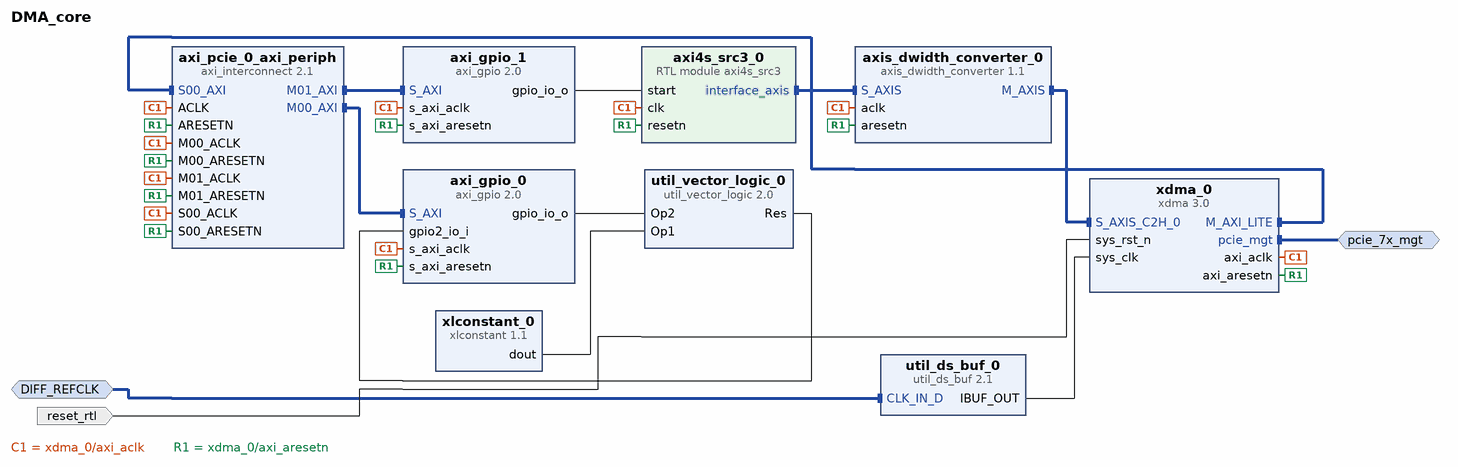
[diagram p0: block diagram of the top level]
# Vivado block design DMA_core, xc7a200tffv1156-2, Vivado 2016.4
create_bd_design DMA_core

create_bd_intf_port -mode Master -vlnv xilinx.com:interface:pcie_7x_mgt_rtl:1.0 pcie_7x_mgt
create_bd_intf_port -mode Slave -vlnv xilinx.com:interface:diff_clock_rtl:1.0 DIFF_REFCLK
set_property -dict {CONFIG.FREQ_HZ 100000000} [get_bd_intf_ports DIFF_REFCLK]
create_bd_port -dir I -type rst reset_rtl
set_property -dict {CONFIG.POLARITY ACTIVE_LOW} [get_bd_ports reset_rtl]

create_bd_cell -type ip -vlnv xilinx.com:ip:axi_gpio:2.0 axi_gpio_0
set_property -dict [list \
  CONFIG.C_IS_DUAL 1 \
  CONFIG.C_ALL_INPUTS 0 \
  CONFIG.C_ALL_INPUTS_2 1 \
  CONFIG.C_ALL_OUTPUTS 1 \
] [get_bd_cells axi_gpio_0]
create_bd_cell -type ip -vlnv xilinx.com:ip:axi_gpio:2.0 axi_gpio_1
set_property -dict {CONFIG.C_GPIO_WIDTH 1 CONFIG.C_ALL_OUTPUTS 1} [get_bd_cells axi_gpio_1]
create_bd_cell -type ip -vlnv xilinx.com:ip:axi_interconnect:2.1 axi_pcie_0_axi_periph
set_property -dict {CONFIG.NUM_SI 1 CONFIG.NUM_MI 2} [get_bd_cells axi_pcie_0_axi_periph]
create_bd_cell -type ip -vlnv xilinx.com:ip:axis_dwidth_converter:1.1 axis_dwidth_converter_0
set_property -dict [list \
  CONFIG.S_TDATA_NUM_BYTES 88 \
  CONFIG.M_TDATA_NUM_BYTES 16 \
  CONFIG.HAS_MI_TKEEP 1 \
] [get_bd_cells axis_dwidth_converter_0]
create_bd_cell -type ip -vlnv xilinx.com:ip:util_vector_logic:2.0 util_vector_logic_0
set_property -dict {CONFIG.C_SIZE 32 CONFIG.C_OPERATION xor} [get_bd_cells util_vector_logic_0]
create_bd_cell -type ip -vlnv xilinx.com:ip:xlconstant:1.1 xlconstant_0
set_property -dict {CONFIG.CONST_WIDTH 32 CONFIG.CONST_VAL 0x12345678} [get_bd_cells xlconstant_0]
create_bd_cell -type ip -vlnv xilinx.com:ip:util_ds_buf:2.1 util_ds_buf_0
set_property -dict {CONFIG.C_BUF_TYPE IBUFDSGTE} [get_bd_cells util_ds_buf_0]
create_bd_cell -type ip -vlnv xilinx.com:ip:xdma:3.0 xdma_0
set_property -dict [list \
  CONFIG.mode_selection Basic \
  CONFIG.pl_link_cap_max_link_width X4 \
  CONFIG.pl_link_cap_max_link_speed 5.0_GT/s \
  CONFIG.axi_data_width 128_bit \
  CONFIG.axisten_freq 125 \
  CONFIG.vendor_id 32ab \
  CONFIG.pf0_device_id 1333 \
  CONFIG.pf0_subsystem_vendor_id 32ab \
  CONFIG.pf0_base_class_menu Device_was_built_before_Class_Code_definitions_were_finalized \
  CONFIG.pf0_class_code_base 00 \
  CONFIG.pf0_sub_class_interface_menu All_currently_implemented_devices_except_VGA-compatible_devices \
  CONFIG.pf0_class_code_sub 00 \
  CONFIG.pf0_class_code_interface 00 \
  CONFIG.axilite_master_en true \
  CONFIG.axilite_master_size 1 \
  CONFIG.axist_bypass_en false \
  CONFIG.pciebar2axibar_axil_master 0x0000000040000000 \
  CONFIG.xdma_rnum_chnl 1 \
  CONFIG.xdma_wnum_chnl 1 \
  CONFIG.xdma_axilite_slave false \
  CONFIG.plltype QPLL1 \
  CONFIG.xdma_axi_intf_mm AXI_Stream \
  CONFIG.xdma_pcie_64bit_en true \
  CONFIG.cfg_mgmt_if false \
  CONFIG.axil_master_64bit_en true \
] [get_bd_cells xdma_0]
create_bd_cell -type module -reference axi4s_src3 axi4s_src3_0

# ---- connections ----

connect_bd_intf_net [get_bd_intf_pins axi4s_src3_0/interface_axis] [get_bd_intf_pins axis_dwidth_converter_0/S_AXIS]
connect_bd_intf_net [get_bd_intf_pins axis_dwidth_converter_0/M_AXIS] [get_bd_intf_pins xdma_0/S_AXIS_C2H_0]
connect_bd_intf_net [get_bd_intf_pins axi_pcie_0_axi_periph/S00_AXI] [get_bd_intf_pins xdma_0/M_AXI_LITE]
connect_bd_intf_net [get_bd_intf_pins axi_pcie_0_axi_periph/M00_AXI] [get_bd_intf_pins axi_gpio_0/S_AXI]
connect_bd_intf_net [get_bd_intf_pins axi_pcie_0_axi_periph/M01_AXI] [get_bd_intf_pins axi_gpio_1/S_AXI]
connect_bd_intf_net [get_bd_intf_ports pcie_7x_mgt] [get_bd_intf_pins xdma_0/pcie_mgt]
connect_bd_intf_net [get_bd_intf_ports DIFF_REFCLK] [get_bd_intf_pins util_ds_buf_0/CLK_IN_D]
connect_bd_net -net axi_pcie_0_axi_aclk_out [get_bd_pins xdma_0/axi_aclk] \
  [get_bd_pins axi_gpio_0/s_axi_aclk] [get_bd_pins axi_gpio_1/s_axi_aclk] [get_bd_pins axis_dwidth_converter_0/aclk] \
  [get_bd_pins axi4s_src3_0/clk] [get_bd_pins axi_pcie_0_axi_periph/ACLK] [get_bd_pins axi_pcie_0_axi_periph/S00_ACLK] \
  [get_bd_pins axi_pcie_0_axi_periph/M00_ACLK] [get_bd_pins axi_pcie_0_axi_periph/M01_ACLK]
connect_bd_net [get_bd_ports reset_rtl] [get_bd_pins xdma_0/sys_rst_n]
connect_bd_net [get_bd_pins xlconstant_0/dout] [get_bd_pins util_vector_logic_0/Op1]
connect_bd_net [get_bd_pins axi_gpio_0/gpio_io_o] [get_bd_pins util_vector_logic_0/Op2]
connect_bd_net [get_bd_pins util_vector_logic_0/Res] [get_bd_pins axi_gpio_0/gpio2_io_i]
connect_bd_net [get_bd_pins axi_gpio_1/gpio_io_o] [get_bd_pins axi4s_src3_0/start]
connect_bd_net [get_bd_pins util_ds_buf_0/IBUF_OUT] [get_bd_pins xdma_0/sys_clk]
connect_bd_net [get_bd_pins xdma_0/axi_aresetn] \
  [get_bd_pins axi_gpio_0/s_axi_aresetn] [get_bd_pins axi_gpio_1/s_axi_aresetn] [get_bd_pins axis_dwidth_converter_0/aresetn] \
  [get_bd_pins axi4s_src3_0/resetn] [get_bd_pins axi_pcie_0_axi_periph/S00_ARESETN] \
  [get_bd_pins axi_pcie_0_axi_periph/M00_ARESETN] [get_bd_pins axi_pcie_0_axi_periph/M01_ARESETN] \
  [get_bd_pins axi_pcie_0_axi_periph/ARESETN]

# ---- address map ----
assign_bd_address -offset 0x40000000 -range 64K -target_address_space [get_bd_addr_spaces xdma_0/M_AXI_LITE] [get_bd_addr_segs axi_gpio_0/S_AXI/Reg]
assign_bd_address -offset 0x40010000 -range 64K -target_address_space [get_bd_addr_spaces xdma_0/M_AXI_LITE] [get_bd_addr_segs axi_gpio_1/S_AXI/Reg]

validate_bd_design
save_bd_design
